# Altium schematic sheet 04_8MPLUS_DRAM.SchDoc: 8MPLUS_DRAM
size 420 x 297 mm; Author: Lukas Henkel; DocumentNumber: 4; SheetNumber: 4; SheetTotal: 16; DocSize: A3
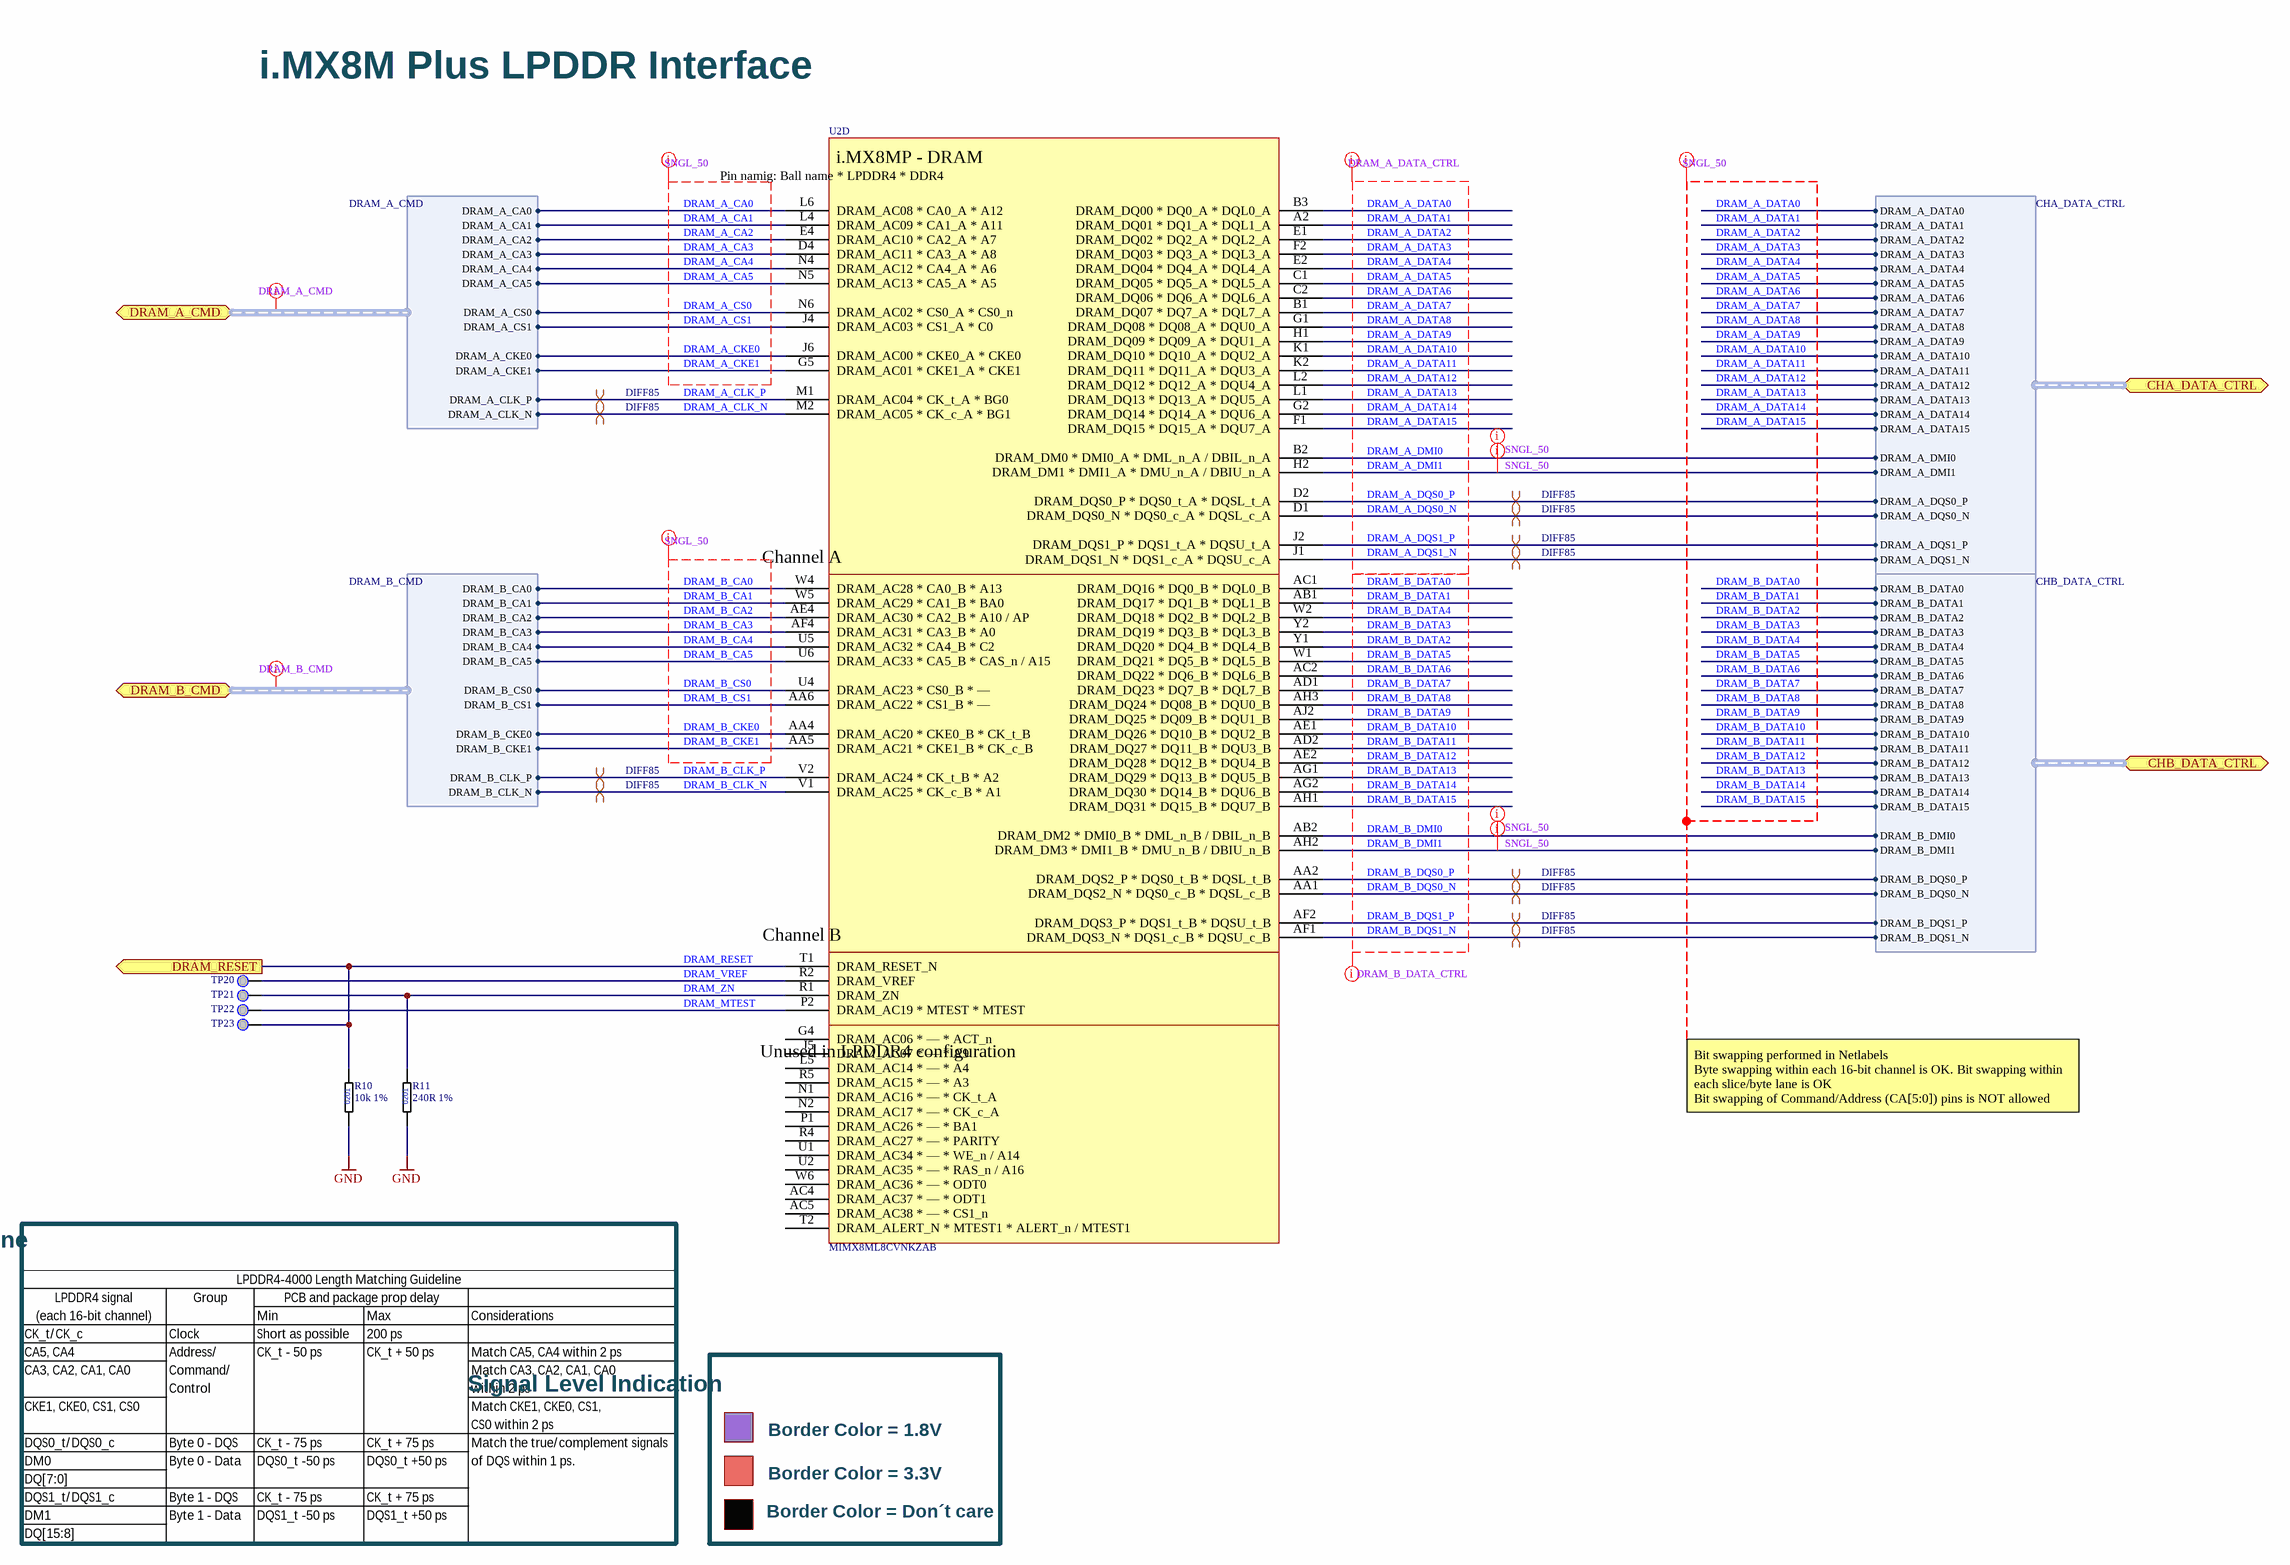
[diagram p0: 04_8MPLUS_DRAM.SchDoc]

## Parts
?  (no value)  (graphical)
R10  10k 1%  [RESC0603X03L]
R11  240R 1%  [RESC0603X03L]
TP20  Testpoint 0.5mm  [TP_0.50mm]  (value not drawn)  (no BOM)
TP21  Testpoint 0.5mm  [TP_0.50mm]  (value not drawn)  (no BOM)
TP22  Testpoint 0.5mm  [TP_0.50mm]  (value not drawn)  (no BOM)
TP23  Testpoint 0.5mm  [TP_0.50mm]  (value not drawn)  (no BOM)
U2  MIMX8ML8CVNKZAB  [BGA548C50P29X29_1500X1500X148]  (part D of 15)

## Ports
CHA_DATA_CTRL (bidir, harness CHA_DATA_CTRL), CHB_DATA_CTRL (bidir, harness CHB_DATA_CTRL), DRAM_A_CMD (bidir, harness DRAM_A_CMD), DRAM_B_CMD (bidir, harness DRAM_B_CMD), DRAM_RESET (out)

## Harnesses
CHA_DATA_CTRL: DRAM_A_DATA0, DRAM_A_DATA1, DRAM_A_DATA2, DRAM_A_DATA3, DRAM_A_DATA4, DRAM_A_DATA5, DRAM_A_DATA6, DRAM_A_DATA7, DRAM_A_DATA8, DRAM_A_DATA9, DRAM_A_DATA10, DRAM_A_DATA11, DRAM_A_DATA12, DRAM_A_DATA13, DRAM_A_DATA14, DRAM_A_DATA15, DRAM_A_DMI0, DRAM_A_DMI1, DRAM_A_DQS0_P, DRAM_A_DQS0_N, DRAM_A_DQS1_P, DRAM_A_DQS1_N
CHB_DATA_CTRL: DRAM_B_DATA0, DRAM_B_DATA1, DRAM_B_DATA2, DRAM_B_DATA3, DRAM_B_DATA4, DRAM_B_DATA5, DRAM_B_DATA6, DRAM_B_DATA7, DRAM_B_DATA8, DRAM_B_DATA9, DRAM_B_DATA10, DRAM_B_DATA11, DRAM_B_DATA12, DRAM_B_DATA13, DRAM_B_DATA14, DRAM_B_DATA15, DRAM_B_DMI0, DRAM_B_DMI1, DRAM_B_DQS0_P, DRAM_B_DQS0_N, DRAM_B_DQS1_P, DRAM_B_DQS1_N
DRAM_A_CMD: DRAM_A_CA0, DRAM_A_CA1, DRAM_A_CA2, DRAM_A_CA3, DRAM_A_CA4, DRAM_A_CA5, DRAM_A_CS0, DRAM_A_CS1, DRAM_A_CKE0, DRAM_A_CKE1, DRAM_A_CLK_P, DRAM_A_CLK_N
DRAM_B_CMD: DRAM_B_CA0, DRAM_B_CA1, DRAM_B_CA2, DRAM_B_CA3, DRAM_B_CA4, DRAM_B_CA5, DRAM_B_CS0, DRAM_B_CS1, DRAM_B_CKE0, DRAM_B_CKE1, DRAM_B_CLK_P, DRAM_B_CLK_N

## Nets
GND: R10.1 R11.1
DRAM_A_CA0: U2.L6(DRAM_AC08_*_CA0_A_*_A12) ; port DRAM_A_CMD.DRAM_A_CA0
DRAM_A_CA1: U2.L4(DRAM_AC09_*_CA1_A_*_A11) ; port DRAM_A_CMD.DRAM_A_CA1
DRAM_A_CA2: U2.E4(DRAM_AC10_*_CA2_A_*_A7) ; port DRAM_A_CMD.DRAM_A_CA2
DRAM_A_CA3: U2.D4(DRAM_AC11_*_CA3_A_*_A8) ; port DRAM_A_CMD.DRAM_A_CA3
DRAM_A_CA4: U2.N4(DRAM_AC12_*_CA4_A_*_A6) ; port DRAM_A_CMD.DRAM_A_CA4
DRAM_A_CA5: U2.N5(DRAM_AC13_*_CA5_A_*_A5) ; port DRAM_A_CMD.DRAM_A_CA5
DRAM_A_CKE0: U2.J6(DRAM_AC00_*_CKE0_A_*_CKE0) ; port DRAM_A_CMD.DRAM_A_CKE0
DRAM_A_CKE1: U2.G5(DRAM_AC01_*_CKE1_A_*_CKE1) ; port DRAM_A_CMD.DRAM_A_CKE1
DRAM_A_CLK_N: U2.M2(DRAM_AC05_*_CK_c_A_*_BG1) ; port DRAM_A_CMD.DRAM_A_CLK_N
DRAM_A_CLK_P: U2.M1(DRAM_AC04_*_CK_t_A_*_BG0) ; port DRAM_A_CMD.DRAM_A_CLK_P
DRAM_A_CS0: U2.N6(DRAM_AC02_*_CS0_A_*_CS0_n) ; port DRAM_A_CMD.DRAM_A_CS0
DRAM_A_CS1: U2.J4(DRAM_AC03_*_CS1_A_*_C0) ; port DRAM_A_CMD.DRAM_A_CS1
DRAM_A_DATA0: U2.B3(DRAM_DQ00_*_DQ0_A_*_DQL0_A) ; port CHA_DATA_CTRL.DRAM_A_DATA0
DRAM_A_DATA1: U2.A2(DRAM_DQ01_*_DQ1_A_*_DQL1_A) ; port CHA_DATA_CTRL.DRAM_A_DATA1
DRAM_A_DATA2: U2.E1(DRAM_DQ02_*_DQ2_A_*_DQL2_A) ; port CHA_DATA_CTRL.DRAM_A_DATA2
DRAM_A_DATA3: U2.F2(DRAM_DQ03_*_DQ3_A_*_DQL3_A) ; port CHA_DATA_CTRL.DRAM_A_DATA3
DRAM_A_DATA4: U2.E2(DRAM_DQ04_*_DQ4_A_*_DQL4_A) ; port CHA_DATA_CTRL.DRAM_A_DATA4
DRAM_A_DATA5: U2.C1(DRAM_DQ05_*_DQ5_A_*_DQL5_A) ; port CHA_DATA_CTRL.DRAM_A_DATA5
DRAM_A_DATA6: U2.C2(DRAM_DQ06_*_DQ6_A_*_DQL6_A) ; port CHA_DATA_CTRL.DRAM_A_DATA6
DRAM_A_DATA7: U2.B1(DRAM_DQ07_*_DQ7_A_*_DQL7_A) ; port CHA_DATA_CTRL.DRAM_A_DATA7
DRAM_A_DATA8: U2.G1(DRAM_DQ08_*_DQ08_A_*_DQU0_A) ; port CHA_DATA_CTRL.DRAM_A_DATA8
DRAM_A_DATA9: U2.H1(DRAM_DQ09_*_DQ09_A_*_DQU1_A) ; port CHA_DATA_CTRL.DRAM_A_DATA9
DRAM_A_DATA10: U2.K1(DRAM_DQ10_*_DQ10_A_*_DQU2_A) ; port CHA_DATA_CTRL.DRAM_A_DATA10
DRAM_A_DATA11: U2.K2(DRAM_DQ11_*_DQ11_A_*_DQU3_A) ; port CHA_DATA_CTRL.DRAM_A_DATA11
DRAM_A_DATA12: U2.L2(DRAM_DQ12_*_DQ12_A_*_DQU4_A) ; port CHA_DATA_CTRL.DRAM_A_DATA12
DRAM_A_DATA13: U2.L1(DRAM_DQ13_*_DQ13_A_*_DQU5_A) ; port CHA_DATA_CTRL.DRAM_A_DATA13
DRAM_A_DATA14: U2.G2(DRAM_DQ14_*_DQ14_A_*_DQU6_A) ; port CHA_DATA_CTRL.DRAM_A_DATA14
DRAM_A_DATA15: U2.F1(DRAM_DQ15_*_DQ15_A_*_DQU7_A) ; port CHA_DATA_CTRL.DRAM_A_DATA15
DRAM_A_DMI0: U2.B2(DRAM_DM0_*_DMI0_A_*_DML_n_A_/_DBIL_n_A) ; port CHA_DATA_CTRL.DRAM_A_DMI0
DRAM_A_DMI1: U2.H2(DRAM_DM1_*_DMI1_A_*_DMU_n_A_/_DBIU_n_A) ; port CHA_DATA_CTRL.DRAM_A_DMI1
DRAM_A_DQS0_N: U2.D1(DRAM_DQS0_N_*_DQS0_c_A_*_DQSL_c_A) ; port CHA_DATA_CTRL.DRAM_A_DQS0_N
DRAM_A_DQS0_P: U2.D2(DRAM_DQS0_P_*_DQS0_t_A_*_DQSL_t_A) ; port CHA_DATA_CTRL.DRAM_A_DQS0_P
DRAM_A_DQS1_N: U2.J1(DRAM_DQS1_N_*_DQS1_c_A_*_DQSU_c_A) ; port CHA_DATA_CTRL.DRAM_A_DQS1_N
DRAM_A_DQS1_P: U2.J2(DRAM_DQS1_P_*_DQS1_t_A_*_DQSU_t_A) ; port CHA_DATA_CTRL.DRAM_A_DQS1_P
DRAM_B_CA0: U2.W4(DRAM_AC28_*_CA0_B_*_A13) ; port DRAM_B_CMD.DRAM_B_CA0
DRAM_B_CA1: U2.W5(DRAM_AC29_*_CA1_B_*_BA0) ; port DRAM_B_CMD.DRAM_B_CA1
DRAM_B_CA2: U2.AE4(DRAM_AC30_*_CA2_B_*_A10_/_AP) ; port DRAM_B_CMD.DRAM_B_CA2
DRAM_B_CA3: U2.AF4(DRAM_AC31_*_CA3_B_*_A0) ; port DRAM_B_CMD.DRAM_B_CA3
DRAM_B_CA4: U2.U5(DRAM_AC32_*_CA4_B_*_C2) ; port DRAM_B_CMD.DRAM_B_CA4
DRAM_B_CA5: U2.U6(DRAM_AC33_*_CA5_B_*_CAS_n_/_A15) ; port DRAM_B_CMD.DRAM_B_CA5
DRAM_B_CKE0: U2.AA4(DRAM_AC20_*_CKE0_B_*_CK_t_B) ; port DRAM_B_CMD.DRAM_B_CKE0
DRAM_B_CKE1: U2.AA5(DRAM_AC21_*_CKE1_B_*_CK_c_B) ; port DRAM_B_CMD.DRAM_B_CKE1
DRAM_B_CLK_N: U2.V1(DRAM_AC25_*_CK_c_B_*_A1) ; port DRAM_B_CMD.DRAM_B_CLK_N
DRAM_B_CLK_P: U2.V2(DRAM_AC24_*_CK_t_B_*_A2) ; port DRAM_B_CMD.DRAM_B_CLK_P
DRAM_B_CS0: U2.U4(DRAM_AC23_*_CS0_B_*_—) ; port DRAM_B_CMD.DRAM_B_CS0
DRAM_B_CS1: U2.AA6(DRAM_AC22_*_CS1_B_*_—) ; port DRAM_B_CMD.DRAM_B_CS1
DRAM_B_DATA0: U2.AC1(DRAM_DQ16_*_DQ0_B_*_DQL0_B) ; port CHB_DATA_CTRL.DRAM_B_DATA0
DRAM_B_DATA1: U2.AB1(DRAM_DQ17_*_DQ1_B_*_DQL1_B) ; port CHB_DATA_CTRL.DRAM_B_DATA1
DRAM_B_DATA2: U2.Y1(DRAM_DQ20_*_DQ4_B_*_DQL4_B) ; port CHB_DATA_CTRL.DRAM_B_DATA2
DRAM_B_DATA3: U2.Y2(DRAM_DQ19_*_DQ3_B_*_DQL3_B) ; port CHB_DATA_CTRL.DRAM_B_DATA3
DRAM_B_DATA4: U2.W2(DRAM_DQ18_*_DQ2_B_*_DQL2_B) ; port CHB_DATA_CTRL.DRAM_B_DATA4
DRAM_B_DATA5: U2.W1(DRAM_DQ21_*_DQ5_B_*_DQL5_B) ; port CHB_DATA_CTRL.DRAM_B_DATA5
DRAM_B_DATA6: U2.AC2(DRAM_DQ22_*_DQ6_B_*_DQL6_B) ; port CHB_DATA_CTRL.DRAM_B_DATA6
DRAM_B_DATA7: U2.AD1(DRAM_DQ23_*_DQ7_B_*_DQL7_B) ; port CHB_DATA_CTRL.DRAM_B_DATA7
DRAM_B_DATA8: U2.AH3(DRAM_DQ24_*_DQ08_B_*_DQU0_B) ; port CHB_DATA_CTRL.DRAM_B_DATA8
DRAM_B_DATA9: U2.AJ2(DRAM_DQ25_*_DQ09_B_*_DQU1_B) ; port CHB_DATA_CTRL.DRAM_B_DATA9
DRAM_B_DATA10: U2.AE1(DRAM_DQ26_*_DQ10_B_*_DQU2_B) ; port CHB_DATA_CTRL.DRAM_B_DATA10
DRAM_B_DATA11: U2.AD2(DRAM_DQ27_*_DQ11_B_*_DQU3_B) ; port CHB_DATA_CTRL.DRAM_B_DATA11
DRAM_B_DATA12: U2.AE2(DRAM_DQ28_*_DQ12_B_*_DQU4_B) ; port CHB_DATA_CTRL.DRAM_B_DATA12
DRAM_B_DATA13: U2.AG1(DRAM_DQ29_*_DQ13_B_*_DQU5_B) ; port CHB_DATA_CTRL.DRAM_B_DATA13
DRAM_B_DATA14: U2.AG2(DRAM_DQ30_*_DQ14_B_*_DQU6_B) ; port CHB_DATA_CTRL.DRAM_B_DATA14
DRAM_B_DATA15: U2.AH1(DRAM_DQ31_*_DQ15_B_*_DQU7_B) ; port CHB_DATA_CTRL.DRAM_B_DATA15
DRAM_B_DMI0: U2.AB2(DRAM_DM2_*_DMI0_B_*_DML_n_B_/_DBIL_n_B) ; port CHB_DATA_CTRL.DRAM_B_DMI0
DRAM_B_DMI1: U2.AH2(DRAM_DM3_*_DMI1_B_*_DMU_n_B_/_DBIU_n_B) ; port CHB_DATA_CTRL.DRAM_B_DMI1
DRAM_B_DQS0_N: U2.AA1(DRAM_DQS2_N_*_DQS0_c_B_*_DQSL_c_B) ; port CHB_DATA_CTRL.DRAM_B_DQS0_N
DRAM_B_DQS0_P: U2.AA2(DRAM_DQS2_P_*_DQS0_t_B_*_DQSL_t_B) ; port CHB_DATA_CTRL.DRAM_B_DQS0_P
DRAM_B_DQS1_N: U2.AF1(DRAM_DQS3_N_*_DQS1_c_B_*_DQSU_c_B) ; port CHB_DATA_CTRL.DRAM_B_DQS1_N
DRAM_B_DQS1_P: U2.AF2(DRAM_DQS3_P_*_DQS1_t_B_*_DQSU_t_B) ; port CHB_DATA_CTRL.DRAM_B_DQS1_P
DRAM_MTEST: TP22.TP U2.P2(DRAM_AC19_*_MTEST_*_MTEST)
DRAM_RESET: R10.2 TP23.TP U2.T1(DRAM_RESET_N) ; port DRAM_RESET
DRAM_VREF: TP20.TP U2.R2(DRAM_VREF)
DRAM_ZN: R11.2 TP21.TP U2.R1(DRAM_ZN)

Not connected (* = marked no-connect by the designer): U2 AC4(DRAM_AC37_*_—_*_ODT1) AC5(DRAM_AC38_*_—_*_CS1_n) G4(DRAM_AC06_*_—_*_ACT_n) J5(DRAM_AC07_*_—_*_A9) L5(DRAM_AC14_*_—_*_A4) N1(DRAM_AC16_*_—_*_CK_t_A) N2(DRAM_AC17_*_—_*_CK_c_A) P1(DRAM_AC26_*_—_*_BA1) R4(DRAM_AC27_*_—_*_PARITY) R5(DRAM_AC15_*_—_*_A3) T2(DRAM_ALERT_N_*_MTEST1_*_ALERT_n_/_MTEST1) U1(DRAM_AC34_*_—_*_WE_n_/_A14) U2(DRAM_AC35_*_—_*_RAS_n_/_A16) W6(DRAM_AC36_*_—_*_ODT0)

## Layout directives
differential pair; differential pair class DIFF85: DRAM_A_CLK_N, DRAM_A_CLK_P, DRAM_A_DQS0_N, DRAM_A_DQS0_P, DRAM_A_DQS1_N, DRAM_A_DQS1_P, DRAM_B_CLK_N, DRAM_B_CLK_P, DRAM_B_DQS0_N, DRAM_B_DQS0_P, DRAM_B_DQS1_N, DRAM_B_DQS1_P
net class DRAM_A_DATA_CTRL: DRAM_A_DATA0, DRAM_A_DATA1, DRAM_A_DATA2, DRAM_A_DATA3, DRAM_A_DATA4, DRAM_A_DATA5, DRAM_A_DATA6, DRAM_A_DATA7, DRAM_A_DATA8, DRAM_A_DATA9, DRAM_A_DATA10, DRAM_A_DATA11, DRAM_A_DATA12, DRAM_A_DATA13, DRAM_A_DATA14, DRAM_A_DATA15, DRAM_A_DMI0, DRAM_A_DMI1, DRAM_A_DQS0_N, DRAM_A_DQS0_P, DRAM_A_DQS1_N, DRAM_A_DQS1_P
net class DRAM_B_DATA_CTRL: DRAM_B_DATA0, DRAM_B_DATA1, DRAM_B_DATA2, DRAM_B_DATA3, DRAM_B_DATA4, DRAM_B_DATA5, DRAM_B_DATA6, DRAM_B_DATA7, DRAM_B_DATA8, DRAM_B_DATA9, DRAM_B_DATA10, DRAM_B_DATA11, DRAM_B_DATA12, DRAM_B_DATA13, DRAM_B_DATA14, DRAM_B_DATA15, DRAM_B_DMI0, DRAM_B_DMI1, DRAM_B_DQS0_N, DRAM_B_DQS0_P, DRAM_B_DQS1_N, DRAM_B_DQS1_P
net class DRAM_B_CMD: (no net found under the mark)
net class DRAM_A_CMD: (no net found under the mark)
net class SNGL_50: DRAM_A_CA0, DRAM_A_CA1, DRAM_A_CA2, DRAM_A_CA3, DRAM_A_CA4, DRAM_A_CA5, DRAM_A_CKE0, DRAM_A_CKE1, DRAM_A_CS0, DRAM_A_CS1, DRAM_A_DATA0, DRAM_A_DATA1, DRAM_A_DATA2, DRAM_A_DATA3, DRAM_A_DATA4, DRAM_A_DATA5, DRAM_A_DATA6, DRAM_A_DATA7, DRAM_A_DATA8, DRAM_A_DATA9, DRAM_A_DATA10, DRAM_A_DATA11, DRAM_A_DATA12, DRAM_A_DATA13, DRAM_A_DATA14, DRAM_A_DATA15, DRAM_A_DMI0, DRAM_A_DMI1, DRAM_B_CA0, DRAM_B_CA1, DRAM_B_CA2, DRAM_B_CA3, DRAM_B_CA4, DRAM_B_CA5, DRAM_B_CKE0, DRAM_B_CKE1, DRAM_B_CS0, DRAM_B_CS1, DRAM_B_DATA0, DRAM_B_DATA1, DRAM_B_DATA2, DRAM_B_DATA3, DRAM_B_DATA4, DRAM_B_DATA5, DRAM_B_DATA6, DRAM_B_DATA7, DRAM_B_DATA8, DRAM_B_DATA9, DRAM_B_DATA10, DRAM_B_DATA11, DRAM_B_DATA12, DRAM_B_DATA13, DRAM_B_DATA14, DRAM_B_DATA15, DRAM_B_DMI0, DRAM_B_DMI1

## Notes on the sheet
- i.MX8M Plus LPDDR Interface
- Bit swapping performed in Netlabels
  Byte swapping within each 16-bit channel is OK. Bit swapping within each slice/byte lane is OK
  Bit swapping of Command/Address (CA[5:0]) pins is NOT allowed
- PCB Layout Length Matching Guideline
- Signal Level Indication
- Border Color = 1.8V
- Border Color = Don´t care
- Border Color = 3.3V
- OV Tech GmbH - Open Visions Technology
- (in symbol RES_0201_10k_1%) 0201
- (in symbol RES_0201_240R_1%) 0201
- (in symbol SoC_i.MX 8M Plus_Quad, part D) i.MX8MP - DRAM; Pin namig: Ball name * LPDDR4 * DDR4; Channel A; Channel B; Unused in LPDDR4 configuration

## Library data of the parts
? = Titleblock_01_OpenSource
R10 = RES_0201_10k_1%: Thick Film Resistors - SMD 10K OHM 1%; Manufacturer 1: Yageo; Manufacturer 1 Prt. Nr.: RC0201FR-0710KL; Manufacturer 2 Prt. Nr.: CRCW020110K0FNED; Manufacturer 2: Vishay / Dale
R11 = RES_0201_240R_1%: Thick Film Resistors - SMD 240 OHM 1%; Manufacturer 1: Yageo; Manufacturer 1 Prt. Nr.: RC0201FR-07240RL; Manufacturer 2 Prt. Nr.: CRCW0201240RFNED; Manufacturer 2: Vishay / Dale
U2 = SoC_i.MX 8M Plus_Quad: i.MX 8M Plus Applications Processor  for Industrial Products; Manufacturer 1: NXP Semiconductor; Manufacturer 1 Prt. Nr.: MIMX8ML8CVNKZAB